# EAGLE design PangandaranV1 (EAGLE 9.1.1)
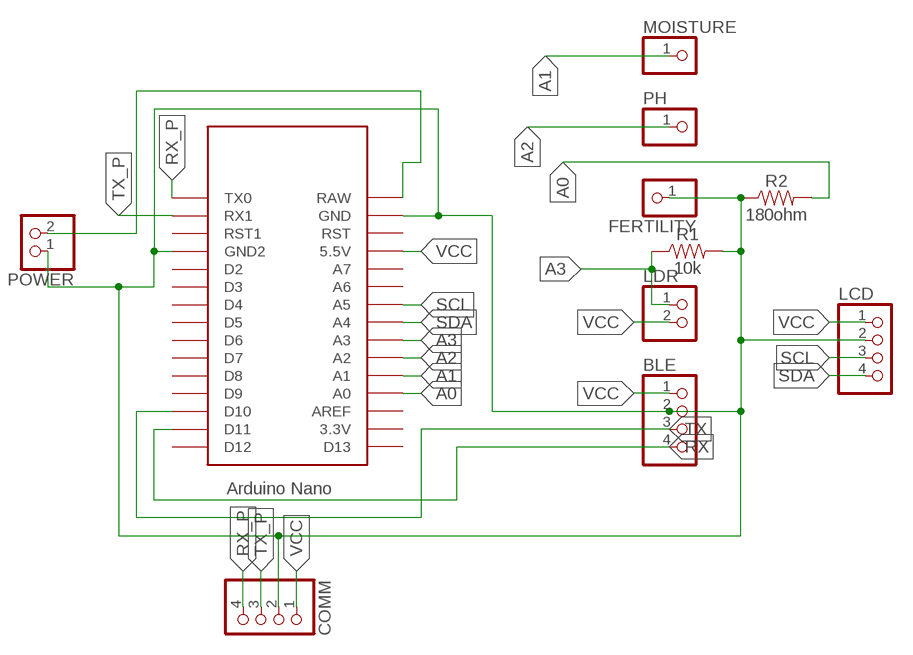
[diagram p0: schematic, sheet 1]

## Parts
BLE  PINHD-1X4  [1X04]
COMM  PINHD-1X4  [1X04]
FERTILITY  PINHD-1X1M  [1X01M]
LCD  PINHD-1X4  [1X04]
LDR  PINHD-1X2  [1X02]
MOISTURE  PINHD-1X1M  [1X01M]
PH  PINHD-1X1M  [1X01M]
POWER  PINHD-1X2  [1X02]
R1  10k  1KOHM-0603-1/10W-1%  [0603]
R2  180ohm  0OHM-0603-1/10W-5%  [0603]
U$2  NANO  [NANO]

## Nets
A0: R2.2 U$2.A0
A1: MOISTURE.1 U$2.A1
A2: PH.1 U$2.A2
A3: LDR.1 R1.1 U$2.A3
GND: BLE.2 COMM.2 FERTILITY.1 LCD.2 POWER.1 R1.2 R2.1 U$2.GND U$2.GND1(GND2)
RX: BLE.4 U$2.D11
RX_P: COMM.4 U$2.TX0
SCL: LCD.3 U$2.A5
SDA: LCD.4 U$2.A4
TX: BLE.3 U$2.D10
TX_P: COMM.3 U$2.RX1
VCC: BLE.1 COMM.1 LCD.1 LDR.2 POWER.2 U$2.5V(5.5V) U$2.RAW
Unconnected: U$2.3.3V U$2.A6 U$2.A7 U$2.AREF U$2.D2 U$2.D3 U$2.D4 U$2.D5 U$2.D6 U$2.D7 U$2.D8 U$2.D9 U$2.D12 U$2.D13 U$2.ICSP1 U$2.ICSP2 U$2.ICSP3 U$2.ICSP4 U$2.ICSP5 U$2.ICSP6 U$2.RST U$2.RST1

## Library data of the parts
BLE COMM LCD = pinhead:PINHD-1X4: PIN HEADER
FERTILITY MOISTURE PH = pinhead:PINHD-1X1: PIN HEADER
LDR POWER = pinhead:PINHD-1X2: PIN HEADER
R1 = SparkFun-Resistors:1KOHM: 1kΩ resistor A resistor is a passive two-terminal electrical component that implements electrical resistance as a circuit element. Resistors act to reduce current flow, and, at the same time, act to lower voltage levels within circuits. - Wikipedia; PROD_ID: RES-07856; VALUE: 1k
R2 = SparkFun-Resistors:0OHM: 0Ω resistor A resistor is a passive two-terminal electrical component that implements electrical resistance as a circuit element. Resistors act to reduce current flow, and, at the same time, act to lower voltage levels within circuits. - Wikipedia; PROD_ID: RES-08609; VALUE: 0
U$2 = Arduino-clone:NANO: Arduino Nano

## Board
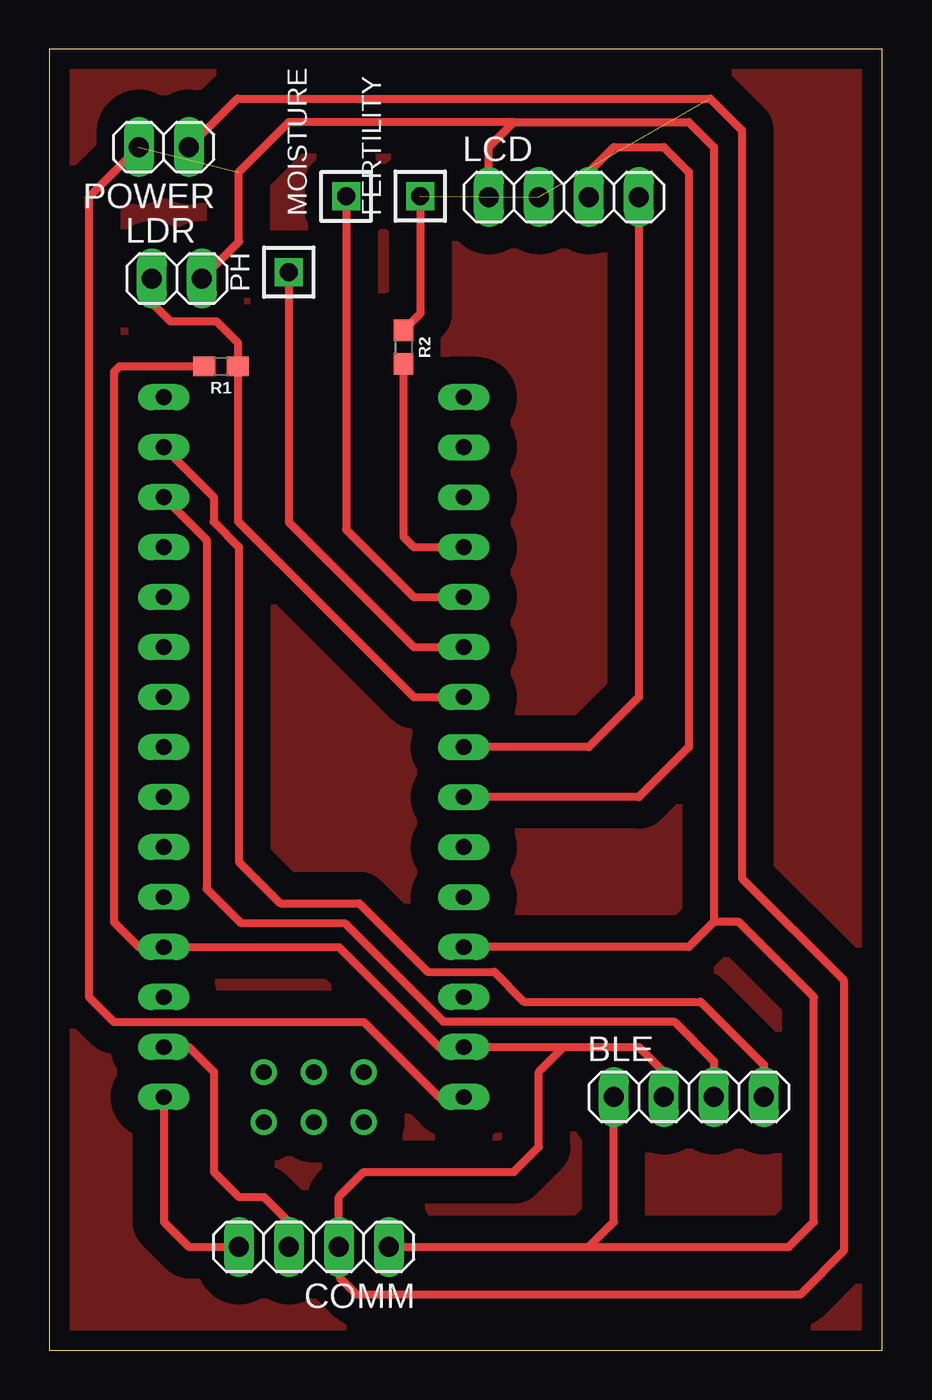
[diagram p1: board, top side]

Size 42.31 x 66.1 mm. Coordinates in mm from the lower left corner, seen from the top.
Outline: 0,0 42.31,0 42.31,66.1 0,66.1 0,0
Copper layers (1*16): Top 0.035mm / dielectric 1.5mm / Bottom 0.035mm
Design rules "default *": minimum track width 6mil, minimum drill 0.35mm, track to track 55mil, track to pad 35mil, pad to pad 6mil, via to via 6mil, smd to smd 6mil, copper to edge 40mil, drill to drill 6mil, minimum pad ring 10mil, minimum via ring 8mil, stop-mask expansion 4mil, vias tented up to drill 0mil, thermal gap 10mil

### Footprints (pad centres in the part's own frame; a part is rotated, then mirrored left to right if it is on the bottom)
1X04 = drill 1.016 long: 1 -3.81,0; 2 -1.27,0; 3 1.27,0; 4 3.81,0
1X01M = drill 0.914 square: 1 0,0
1X02 = drill 1.016 long: 1 -1.27,0; 2 1.27,0
0603 = smd 1.1 x 1: 1 -0.85,0; 2 0.85,0
NANO = drill 0.8 long: 3.3V -10.16,24.13; 5V -10.16,-1.27; A0 -10.16,19.05; A1 -10.16,16.51; A2 -10.16,13.97; A3 -10.16,11.43; A4 -10.16,8.89; A5 -10.16,6.35; A6 -10.16,3.81; A7 -10.16,1.27; AREF -10.16,21.59; D2 5.08,1.27; D3 5.08,3.81; D4 5.08,6.35; D5 5.08,8.89; D6 5.08,11.43; D7 5.08,13.97; D8 5.08,16.51; D9 5.08,19.05; D10 5.08,21.59; D11 5.08,24.13; D12 5.08,26.67; D13 -10.16,26.67; GND -10.16,-6.35; GND1 5.08,-1.27; RAW -10.16,-8.89; RST -10.16,-3.81; RST1 5.08,-3.81; RX1 5.08,-6.35; TX0 5.08,-8.89 | drill 0.8: ICSP1 -5.08,-10.16; ICSP2 -5.08,-7.62; ICSP3 -2.54,-10.16; ICSP4 -2.54,-7.62; ICSP5 0,-10.16; ICSP6 0,-7.62

### Placement (x,y rotation side)
BLE  32.49,12.87 0 top
COMM  13.44,5.25 180 top
FERTILITY  18.85,58.63 0 top
LCD  26.14,58.59 0 top
LDR  6.48,54.45 0 top
MOISTURE  15.08,58.63 0 top
PH  12.17,54.78 0 top
POWER  5.82,61.13 180 top
R1  8.73,49.98 180 top
R2  17.99,50.97 270 top
U$2  10.9,21.76 0 bottom

### Tracks (layer width: path | path; a pad name or v marks a point on that pad's centre or on a via)
A0
  Top 0.406: U$2.A0 18.52,40.81 17.99,41.34 R2.2
A1
  Top 0.406: MOISTURE.1 15.08,41.71 18.52,38.27 U$2.A1
A2
  Top 0.406: PH.1 12.17,42.08 18.52,35.73 U$2.A2
A3
  Top 0.406: U$2.A3 18.52,33.19 9.58,42.13 R1.1 9.58,51.19 8.49,52.28 6.15,52.28 5.21,53.21 LDR.1
GND  (2 unrouted)
  Top 0.406: FERTILITY.1 18.85,52.68 R2.1 | COMM.2 14.71,5.66 | 14.71,5.66 14.71,7.79 15.98,9.06 23.6,9.06 24.87,10.33 24.87,14.14 26.14,15.41 | 26.14,15.41 29.95,15.41 31.22,14.14 BLE.2 | 26.14,15.41 U$2.GND 19.79,15.41 14.71,20.49 U$2.GND1 4.55,20.49 3.28,21.76 3.28,49.7 3.56,49.98 R1.2 | POWER.1 9.55,63.59 33.58,63.59 35.18,61.99 35.18,23.98 40.34,18.82 40.34,5.04 38.13,2.83 15.62,2.83 14.76,3.69 14.76,5.61 14.71,5.66
N$1
  pour Top: -0.12,65.93 42.31,65.93 42.31,0.12 -0.12,0.12
RX
  Top 0.406: U$2.D11 8.35,43.35 8.35,42.09 9.63,40.81 9.63,24.81 11.74,22.71 15.74,22.71 19.21,19.23 22.59,19.23 24.11,17.71 33.09,17.71 36.3,14.5 BLE.4
RX_P
  Top 0.406: COMM.4 7.09,5.25 5.82,6.52 U$2.TX0
SCL
  Top 0.406: LCD.3 27.41,59.86 28.68,61.13 31.22,61.13 32.49,59.86 32.49,30.65 29.95,28.11 U$2.A5
SDA
  Top 0.406: LCD.4 29.95,33.19 27.41,30.65 U$2.A4
TX
  Top 0.406: U$2.D10 8,41.16 8,23.44 9.74,21.71 15,21.71 20,16.71 31.74,16.71 33.76,14.69 BLE.3
TX_P
  Top 0.406: U$2.RX1 7.09,15.41 8.36,14.14 8.36,9.06 9.63,7.79 10.9,7.79 12.17,6.52 COMM.3
VCC  (1 unrouted)
  Top 0.406: POWER.2 2.01,58.59 2.01,17.95 3.28,16.68 15.98,16.68 19.79,12.87 U$2.RAW | COMM.1 27.41,5.25 | 27.41,5.25 28.68,6.52 BLE.1 | LCD.1 22.33,61.13 23.6,62.4 | 23.6,62.4 32.49,62.4 33.76,61.13 33.76,21.76 | 33.76,21.76 32.49,20.49 U$2.5V | 33.76,21.76 35.03,21.76 38.84,17.95 38.84,6.52 37.57,5.25 27.41,5.25 | 23.6,62.4 12.17,62.4 9.63,59.86 9.63,56.32 LDR.2